# EAGLE design IE ARSA Merah W 4 L (EAGLE 8.4.3)
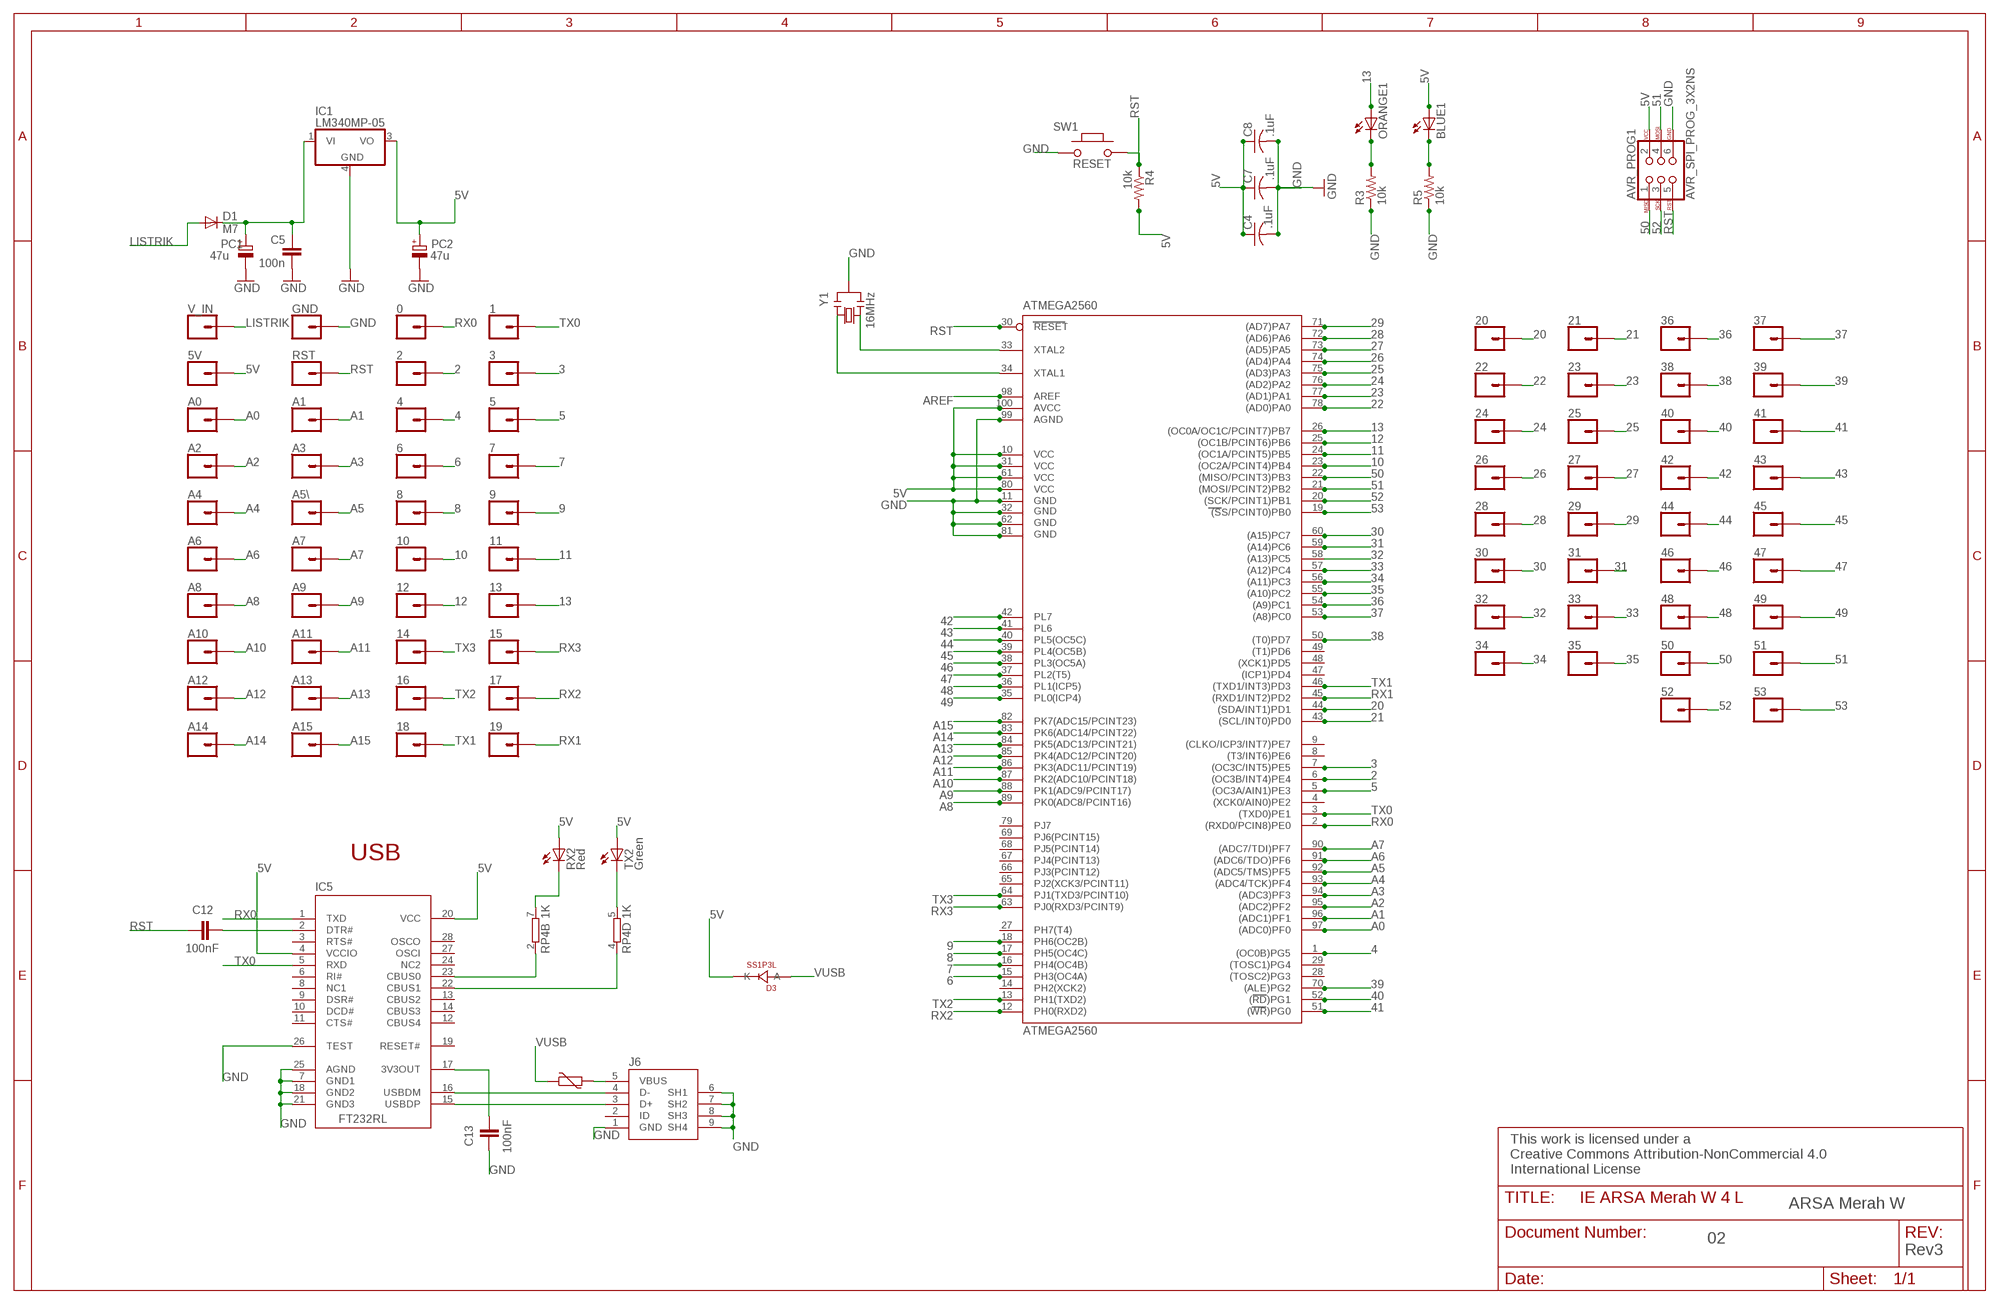
[diagram p0: schematic, sheet 1]

## Parts
0  CONN_01  [1X01]
1  CONN_01  [1X01]
2  CONN_01  [1X01]
3  CONN_01  [1X01]
4  CONN_01  [1X01]
5  CONN_01  [1X01]
5V  CONN_01  [1X01]
6  CONN_01  [1X01]
7  CONN_01  [1X01]
8  CONN_01  [1X01]
9  CONN_01  [1X01]
10  CONN_01  [1X01]
11  CONN_01  [1X01]
12  CONN_01  [1X01]
13  CONN_01  [1X01]
14  CONN_01  [1X01]
15  CONN_01  [1X01]
16  CONN_01  [1X01]
17  CONN_01  [1X01]
18  CONN_01  [1X01]
19  CONN_01  [1X01]
20  CONN_01  [1X01]
21  CONN_01  [1X01]
22  CONN_01  [1X01]
23  CONN_01  [1X01]
24  CONN_01  [1X01]
25  CONN_01  [1X01]
26  CONN_01  [1X01]
27  CONN_01  [1X01]
28  CONN_01  [1X01]
29  CONN_01  [1X01]
30  CONN_01  [1X01]
31  CONN_01  [1X01]
32  CONN_01  [1X01]
33  CONN_01  [1X01]
34  CONN_01  [1X01]
35  CONN_01  [1X01]
36  CONN_01  [1X01]
37  CONN_01  [1X01]
38  CONN_01  [1X01]
39  CONN_01  [1X01]
40  CONN_01  [1X01]
41  CONN_01  [1X01]
42  CONN_01  [1X01]
43  CONN_01  [1X01]
44  CONN_01  [1X01]
45  CONN_01  [1X01]
46  CONN_01  [1X01]
47  CONN_01  [1X01]
48  CONN_01  [1X01]
49  CONN_01  [1X01]
50  CONN_01  [1X01]
51  CONN_01  [1X01]
52  CONN_01  [1X01]
53  CONN_01  [1X01]
A0  CONN_01  [1X01]
A1  CONN_01  [1X01]
A2  CONN_01  [1X01]
A3  CONN_01  [1X01]
A4  CONN_01  [1X01]
A5\  CONN_01  [1X01]
A6  CONN_01  [1X01]
A7  CONN_01  [1X01]
A8  CONN_01  [1X01]
A9  CONN_01  [1X01]
A10  CONN_01  [1X01]
A11  CONN_01  [1X01]
A12  CONN_01  [1X01]
A13  CONN_01  [1X01]
A14  CONN_01  [1X01]
A15  CONN_01  [1X01]
ATMEGA2560  ATMEGA2560  [TQFP100]
AVR_PROG1  AVR_SPI_PROG_3X2NS  [2X3-NS]
BLUE1  L  LED-SMD-0805  [SMD-0805-LED]
C4  CAPACITOR-SMD-0805  [SMD-0805]
C5  100n  C-EU0603-RND  [C0603-ROUND]
C7  .1uF  CAPACITOR-SMD-0805  [SMD-0805]
C8  .1uF  CAPACITOR-SMD-0805  [SMD-0805]
C12  100nF  0015_100NF_0603  [C0603-ROUND]
C13  100nF  0015_100NF_0603  [C0603-ROUND]
D1  M7  DIODE-SMB  [SMB]
D3  SS1P3L  0025_SS1P3L-M3/84A  [DO220AAL]
F3  MFFSMF050  PTC  [0603-1608X90N]
GND  CONN_01  [1X01]
IC1  LM340MP-05  [SOT223]
IC5  FT232RL  0226_FT232RL  [SSOP28]
J6  0219_14850  [USB-MINI-B_2]
ORANGE1  L  LED-SMD-0805  [SMD-0805-LED]
PC1  47u  CPOL-EUD  [PANASONIC_D]
PC2  47u  CPOL-EUD  [PANASONIC_D]
R3  10k  RESISTOR-SMD-0805  [SMD-0805]
R4  10k  RESISTOR-SMD-0805  [SMD-0805]
R5  10k  RESISTOR-SMD-0805  [SMD-0805]
RP4  1K  0005_064R_1K_/_CAY16-102J4LF  [CAY16]
RST  CONN_01  [1X01]
RX2  Red  0181_KTP-2012SURCK  [CHIPLED_0805]
SW1  RESET  0173_IT-1185AP1C-160G-G_T&R  [SMD_157SW]
TX2  Green  0043_KPT-2012SGC  [CHIPLED_0805]
V_IN  CONN_01  [1X01]
Y1  16MHz  0011_CSTCE16M0V53-R0  [RESONATOR]

## Nets
2: 2.1 ATMEGA2560.6((OC3B/INT4)PE4)
3: 3.1 ATMEGA2560.7((OC3C/INT5)PE5)
4: 4.1 ATMEGA2560.1((OC0B)PG5)
5: 5.1 ATMEGA2560.5((OC3A/AIN1)PE3)
5V: 5V.1 ATMEGA2560.10(VCC) ATMEGA2560.31(VCC1) ATMEGA2560.61(VCC2) ATMEGA2560.80(VCC3) ATMEGA2560.100(AVCC) AVR_PROG1.2 BLUE1.1(A) C4.1 C7.1 C8.1 D3.P$1(K) IC1.3(VO) IC5.4(VCCIO) IC5.20(VCC) PC2.+ R4.2 RX2.A TX2.A
6: 6.1 ATMEGA2560.15(PH3(OC4A))
7: 7.1 ATMEGA2560.16(PH4(OC4B))
8: 8.1 ATMEGA2560.17(PH5(OC4C))
9: 9.1 ATMEGA2560.18(PH6(OC2B))
10: 10.1 ATMEGA2560.23((OC2A/PCINT4)PB4)
11: 11.1 ATMEGA2560.24((OC1A/PCINT5)PB5)
12: 12.1 ATMEGA2560.25((OC1B/PCINT6)PB6)
13: 13.1 ATMEGA2560.26((OC0A/OC1C/PCINT7)PB7) ORANGE1.1(A)
20: 20.1 ATMEGA2560.44((SDA/INT1)PD1)
21: 21.1 ATMEGA2560.43((SCL/INT0)PD0)
22: 22.1 ATMEGA2560.78((AD0)PA0)
23: 23.1 ATMEGA2560.77((AD1)PA1)
24: 24.1 ATMEGA2560.76((AD2)PA2)
25: 25.1 ATMEGA2560.75((AD3)PA3)
26: 26.1 ATMEGA2560.74((AD4)PA4)
27: 27.1 ATMEGA2560.73((AD5)PA5)
28: 28.1 ATMEGA2560.72((AD6)PA6)
29: 29.1 ATMEGA2560.71((AD7)PA7)
30: 30.1 ATMEGA2560.60((A15)PC7)
31: 31.1 ATMEGA2560.59((A14)PC6)
32: 32.1 ATMEGA2560.58((A13)PC5)
33: 33.1 ATMEGA2560.57((A12)PC4)
34: 34.1 ATMEGA2560.56((A11)PC3)
35: 35.1 ATMEGA2560.55((A10)PC2)
36: 36.1 ATMEGA2560.54((A9)PC1)
37: 37.1 ATMEGA2560.53((A8)PC0)
38: 38.1 ATMEGA2560.50((T0)PD7)
39: 39.1 ATMEGA2560.70((ALE)PG2)
40: 40.1 ATMEGA2560.52((RD)PG1)
41: 41.1 ATMEGA2560.51((WR)PG0)
42: 42.1 ATMEGA2560.42(PL7)
43: 43.1 ATMEGA2560.41(PL6)
44: 44.1 ATMEGA2560.40(PL5(OC5C))
45: 45.1 ATMEGA2560.39(PL4(OC5B))
46: 46.1 ATMEGA2560.38(PL3(OC5A))
47: 47.1 ATMEGA2560.37(PL2(T5))
48: 48.1 ATMEGA2560.36(PL1(ICP5))
49: 49.1 ATMEGA2560.35(PL0(ICP4))
50: 50.1 ATMEGA2560.22((MISO/PCINT3)PB3) AVR_PROG1.1
51: 51.1 ATMEGA2560.21((MOSI/PCINT2)PB2) AVR_PROG1.4
52: 52.1 ATMEGA2560.20((SCK/PCINT1)PB1) AVR_PROG1.3
53: 53.1 ATMEGA2560.19((SS/PCINT0)PB0)
A0: A0.1 ATMEGA2560.97((ADC0)PF0)
A1: A1.1 ATMEGA2560.96((ADC1)PF1)
A2: A2.1 ATMEGA2560.95((ADC2)PF2)
A3: A3.1 ATMEGA2560.94((ADC3)PF3)
A4: A4.1 ATMEGA2560.93((ADC4/TCK)PF4)
A5: A5\.1 ATMEGA2560.92((ADC5/TMS)PF5)
A6: A6.1 ATMEGA2560.91((ADC6/TDO)PF6)
A7: A7.1 ATMEGA2560.90((ADC7/TDI)PF7)
A8: A8.1 ATMEGA2560.89(PK0(ADC8/PCINT16))
A9: A9.1 ATMEGA2560.88(PK1(ADC9/PCINT17))
A10: A10.1 ATMEGA2560.87(PK2(ADC10/PCINT18))
A11: A11.1 ATMEGA2560.86(PK3(ADC11/PCINT19))
A12: A12.1 ATMEGA2560.85(PK4(ADC12/PCINT20))
A13: A13.1 ATMEGA2560.84(PK5(ADC13/PCINT21))
A14: A14.1 ATMEGA2560.83(PK6(ADC14/PCINT22))
A15: A15.1 ATMEGA2560.82(PK7(ADC15/PCINT23))
AREF: ATMEGA2560.98(AREF)
GND: ATMEGA2560.11(GND) ATMEGA2560.32(GND1) ATMEGA2560.62(GND2) ATMEGA2560.81(GND3) ATMEGA2560.99(AGND) AVR_PROG1.6 C4.2 C5.2 C7.2 C8.2 C13.1 GND.1 IC1.4(GND) IC5.7(GND1) IC5.18(GND2) IC5.21(GND3) IC5.25(AGND) IC5.26(TEST) J6.1(GND) J6.6(SH1) J6.7(SH2) J6.8(SH3) J6.9(SH4) PC1.- PC2.- R3.1 R5.1 SW1.1 Y1.2
LISTRIK: D1.A V_IN.1
N$1: ORANGE1.2(C) R3.2
N$2: ATMEGA2560.33(XTAL2) Y1.3
N$3: BLUE1.2(C) R5.2
N$4: ATMEGA2560.34(XTAL1) Y1.1
N$19: C12.2 IC5.2(DTR#)
N$20: IC5.15(USBDP) J6.3(D+)
N$21: IC5.16(USBDM) J6.4(D-)
N$22: IC5.23(CBUS0) RP4.2
N$23: IC5.22(CBUS1) RP4.4
N$24: RP4.5 TX2.C
N$25: F3.2 J6.5(VBUS)
N$27: RP4.7 RX2.C
N$28: C13.2 IC5.17(3V3OUT)
RST: ATMEGA2560.30(RESET) AVR_PROG1.5 C12.1 R4.1 RST.1 SW1.2
RX0: 0.1 ATMEGA2560.2((RXD0/PCIN8)PE0) IC5.1(TXD)
RX1: 19.1 ATMEGA2560.45((RXD1/INT2)PD2)
RX2: 17.1 ATMEGA2560.12(PH0(RXD2))
RX3: 15.1 ATMEGA2560.63(PJ0(RXD3/PCINT9))
TX0: 1.1 ATMEGA2560.3((TXD0)PE1) IC5.5(RXD)
TX1: 18.1 ATMEGA2560.46((TXD1/INT3)PD3)
TX2: 16.1 ATMEGA2560.13(PH1(TXD2))
TX3: 14.1 ATMEGA2560.64(PJ1(TXD3/PCINT10))
VIN: C5.1 D1.C IC1.1(VI) PC1.+
VUSB: D3.P$2(A) F3.1
Unconnected: ATMEGA2560.4((XCK0/AIN0)PE2) ATMEGA2560.8((T3/INT6)PE6) ATMEGA2560.9((CLKO/ICP3/INT7)PE7) ATMEGA2560.14(PH2(XCK2)) ATMEGA2560.27(PH7(T4)) ATMEGA2560.28((TOSC2)PG3) ATMEGA2560.29((TOSC1)PG4) ATMEGA2560.47((ICP1)PD4) ATMEGA2560.48((XCK1)PD5) ATMEGA2560.49((T1)PD6) ATMEGA2560.65(PJ2(XCK3/PCINT11)) ATMEGA2560.66(PJ3(PCINT12)) ATMEGA2560.67(PJ4(PCINT13)) ATMEGA2560.68(PJ5(PCINT14)) ATMEGA2560.69(PJ6(PCINT15)) ATMEGA2560.79(PJ7) IC5.3(RTS#) IC5.6(RI#) IC5.8(NC1) IC5.9(DSR#) IC5.10(DCD#) IC5.11(CTS#) IC5.12(CBUS4) IC5.13(CBUS2) IC5.14(CBUS3) IC5.19(RESET#) IC5.24(NC2) IC5.27(OSCI) IC5.28(OSCO) J6.2(ID) RP4.1 RP4.3 RP4.6 RP4.8

## Notes on the sheet
- .1uF
- USB
- This work is licensed under a 
  Creative Commons Attribution-NonCommercial 4.0
  International License
- ARSA Merah W
- 02
- Rev3

## Library data of the parts
0 1-5 5V 6-53 A0 A1-A4 A5\ A6-A15 GND RST V_IN = SparkFun-Connectors:CONN_01: Single connection point. Often used as Generic Header-pin footprint for 0.1 inch spaced/style header connections On any of the 0.1 inch spaced packages, you can populate with these: Break Away Headers - Straight <https://www.sparkfun.com/products/116> (PRT-00116) Break Away Male Headers - Right Angle <https://www.sparkfun.com/products/553> (PRT-00553) Female Headers <https://www.sparkfun.com/products/115> (PRT-00115) Break Away Headers - Machine Pin <https://www.sparkfun.com/products/117> (PRT-00117) Break Away Female Headers - Swiss Machine Pin <https://www.sparkfun.com/products/743> (PRT-00743) This device is also useful as a general connection point to wire up your design to another part of your project. Our various solder wires solder well into these plated through hole pads. Hook-Up Wire - Assortment (Stranded, 22 AWG) <https://www.sparkfun.com/products/11375> (PRT-11375) Hook-Up Wire - Assortment (Solid Core, 22 AWG) <https://www.sparkfun.com/products/11367> (PRT-11367) View the entire wire category on our website here <https://www.sparkfun.com/categories/141> Special notes: SMTSO-256-ET is a "flush mount" nut for a 4-40 screw. We mostly use this on specialty testbeds; it is a nice way to connect hardware to your PCB at an adjustable hieght. Also note, the SNAP packages are for using a snappable style connector. We sell a baggie of snaps and they are also used on two LilyPad designs: Snap Assortment - 30 pack (male and female) <https://www.sparkfun.com/products/11347> (DEV-11347) LilyPad Arduino SimpleSnap <https://www.sparkfun.com/products/10941> (DEV-10941) LilyPad SimpleSnap Protoboard <https://www.sparkfun.com/products/10940> (DEV-10940)
ATMEGA2560 = Fuzzy:ATMEGA2560
AVR_PROG1 = SparkFun-Connectors:AVR_SPI_PROG_3X2: AVR ISP 6 Pin This is the reduced ISP connector for AVR programming. Common on Arduino. This footprint will take up less PCB space and can be used with a 10-pin to 6-pin adapter such as SKU: BOB-08508 **Special note about "TEST_POINT" package. The stop mask is on the top side, so if you want your programming test points to be on the bottom of your board, make sure to place this package on the bottom side of the board. This also ensure that the orientation to program from the bottom side will be correct. SparkFun Products: SparkFun ISP Pogo Adapter <https://www.sparkfun.com/products/11591> - NS Tiny AVR Programmer <https://www.sparkfun.com/products/11801> -PTH
BLUE1 ORANGE1 = Fuzzy:LED-SMD-0805
C4 C7 C8 = Fuzzy:CAPACITOR-SMD-0805
C5 = SmartPrj:C-EU: CAPACITOR, European symbol
C12 C13 = Condensatori:0015_100NF_0603: 100nF 0603 50V; CASE: 0603; MONTHLY_USAGE: _____; PART_NUMBER: cl10b104kbnc; PRICE: _____; SUPPLIER: _____; TYPE: Condensatori
D1 = diode:DIODE-: DIODE
D3 = Diodi:0025_SS1P3L-M3/84A: 1A 30V Schottky Barrier Rectifiers -SS1P3L-M3/84A; CASE: SMP; MONTHLY_USAGE: _____; PART_NUMBER: SS1P3L-M3/84A; PRICE: _____; SUPPLIER: _____; TYPE: Diodi
F3 = Arduino-rcl:PTC: SMD PTC; DATASHEET: http://www.bourns.com/docs/Product-Datasheets/mffsmf.pdf; DISTRIBUTOR-LINK: http://www.digikey.com/product-detail/en/bourns-inc/MF-FSMF050X-2/MF-FSMF050X-2CT-ND/2039389; DISTRIBUTOR-PN: MF-FSMF050X-2CT-ND; MANUFACTURER: Bourns Inc; MANUFACTURER-PN: MF-FSMF050X-2
IC1 = linear:LM340?-*: Positive VOLTAGE REGULATOR Source: http://cache.national.com/ds/LM/LM340.pdf
IC5 = IntegratedCircuits:0226_FT232RL: USB to serial UART interface -FT232RL; CASE: SSOP28; MONTHLY_USAGE: _____; PART_NUMBER: FT232RL; PRICE: _____; SUPPLIER: _____; TYPE: Circuito_Integrato
J6 = Connettori:0219_14850: Usb-Mini F 90 Smd; MONTHLY_USAGE: _____; PART_NUMBER: 14850; PRICE: _____; SUPPLIER: _____; TYPE: Connettori; VALUE: USB-mini-90 -SMD
PC1 PC2 = rcl:CPOL-EU: POLARIZED CAPACITOR, European symbol
R3-R5 = Fuzzy:RESISTOR-SMD-0805
RP4 = Resistenze:0005_064R_1K_/_CAY16-102J4LF: 1K 064R; CASE: SMD_3,2x1,6; MONTHLY_USAGE: _____; PART_NUMBER: 064R_1K_/_CAY16-102J4LF; PRICE: _____; SUPPLIER: _____; TYPE: Resistenze
RX2 = Opto:0181_KTP-2012SURCK: LED RED - SMD - 0805; MONTHLY_USAGE: _____; PART_NUMBER: KTP-2012SURCK; PRICE: _____; SUPPLIER: _____; TYPE: Opto
SW1 = Switches:0173_IT-1185AP1C-160G-G_T&R: Pushbutton 4x3 SMD H2,5mm; MONTHLY_USAGE: _____; PART_NUMBER: IT-1185AP1C-160G-G_T&R; PRICE: _____; SUPPLIER: _____; TYPE: Switches; VALUE: 157SW
TX2 = Opto:0043_KPT-2012SGC: LED GREEN - SMD-0805; MONTHLY_USAGE: _____; PART_NUMBER: KPT-2012SGC; PRICE: _____; SUPPLIER: _____; TYPE: Opto
Y1 = Cristalli:0011_CSTCE16M0V53-R0: 16Mhz - SMD; MONTHLY_USAGE: _____; PART_NUMBER: CSTCE16M0V53-R0; PRICE: _____; SUPPLIER: _____; TYPE: Cristalli; VALUE: CSTCE16M0V53-R0

## Net classes
0 default: width 0.15 mm, drill 0.3 mm, clearance 0.15 mm
1 Power: width 0.46 mm, drill 0.3 mm, clearance 0.15 mm

## Board
ARSA Merah W
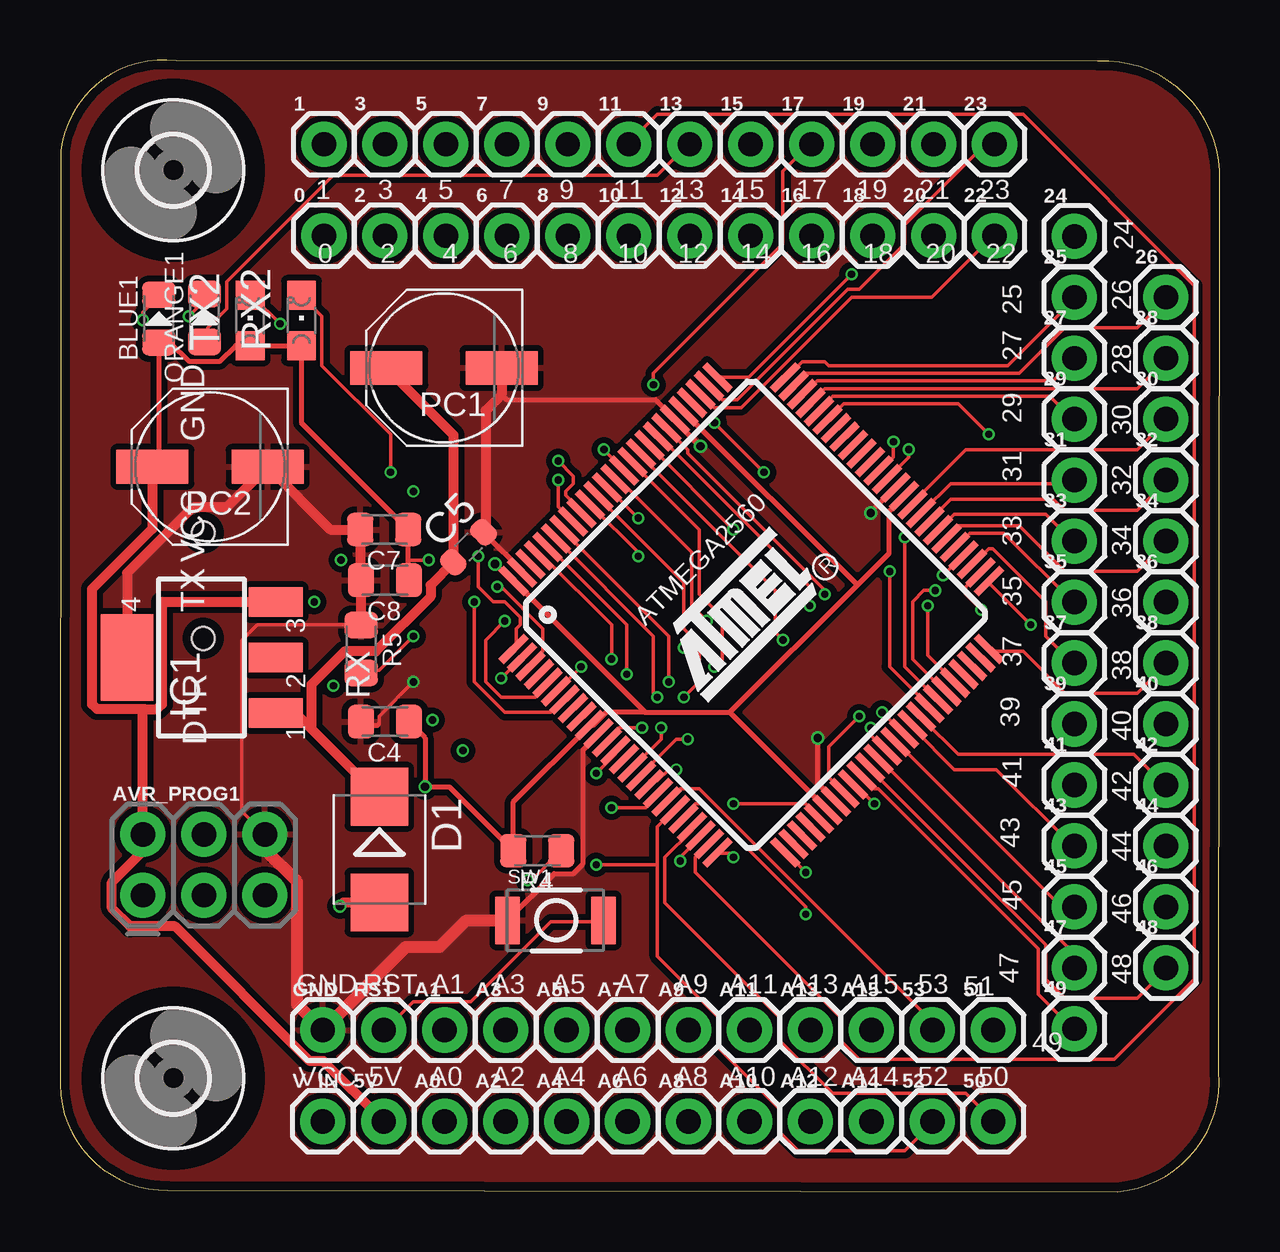
[diagram p1: board, top side]
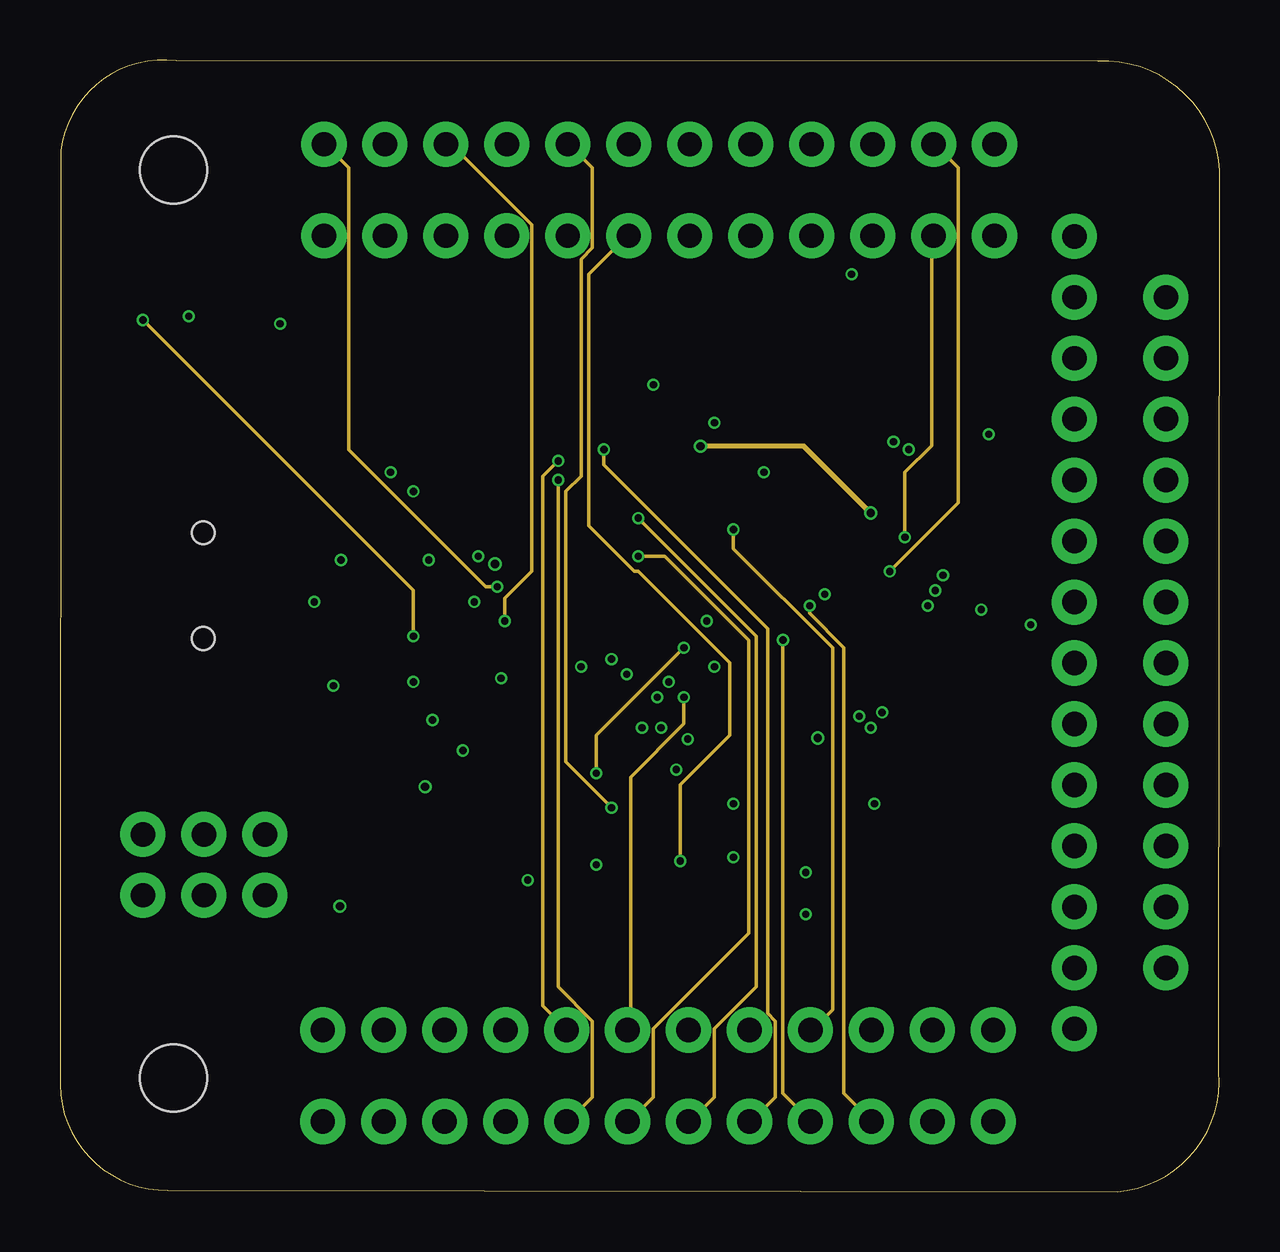
[diagram p2: board, inner layer Route2]
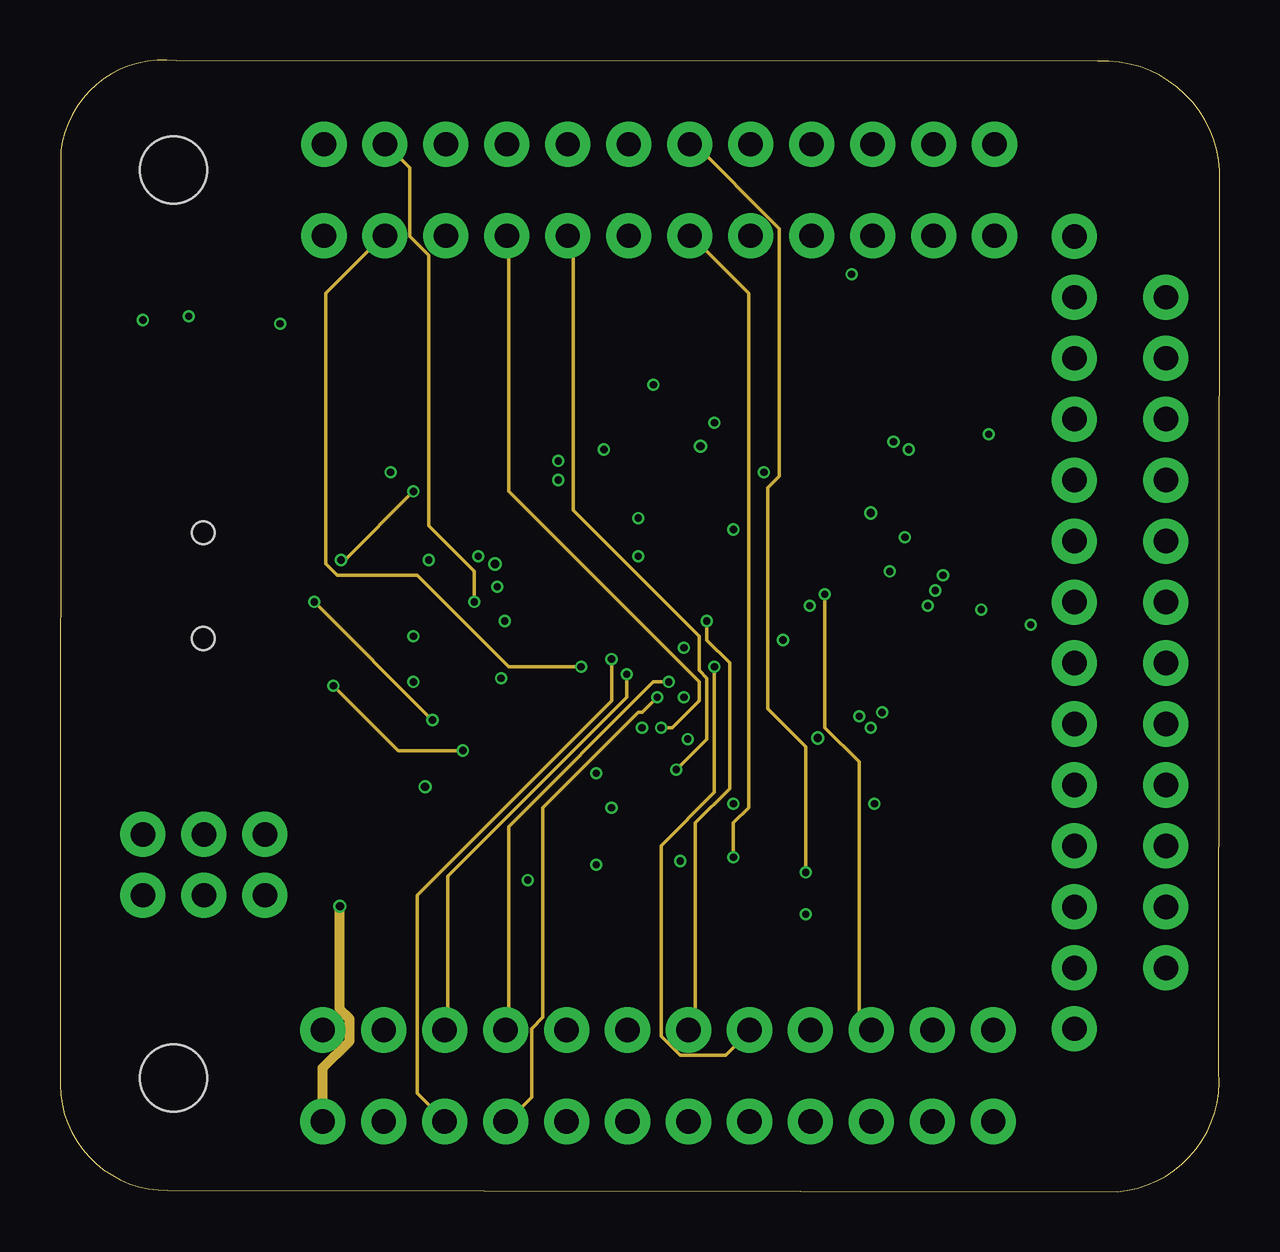
[diagram p3: board, inner layer Route15]
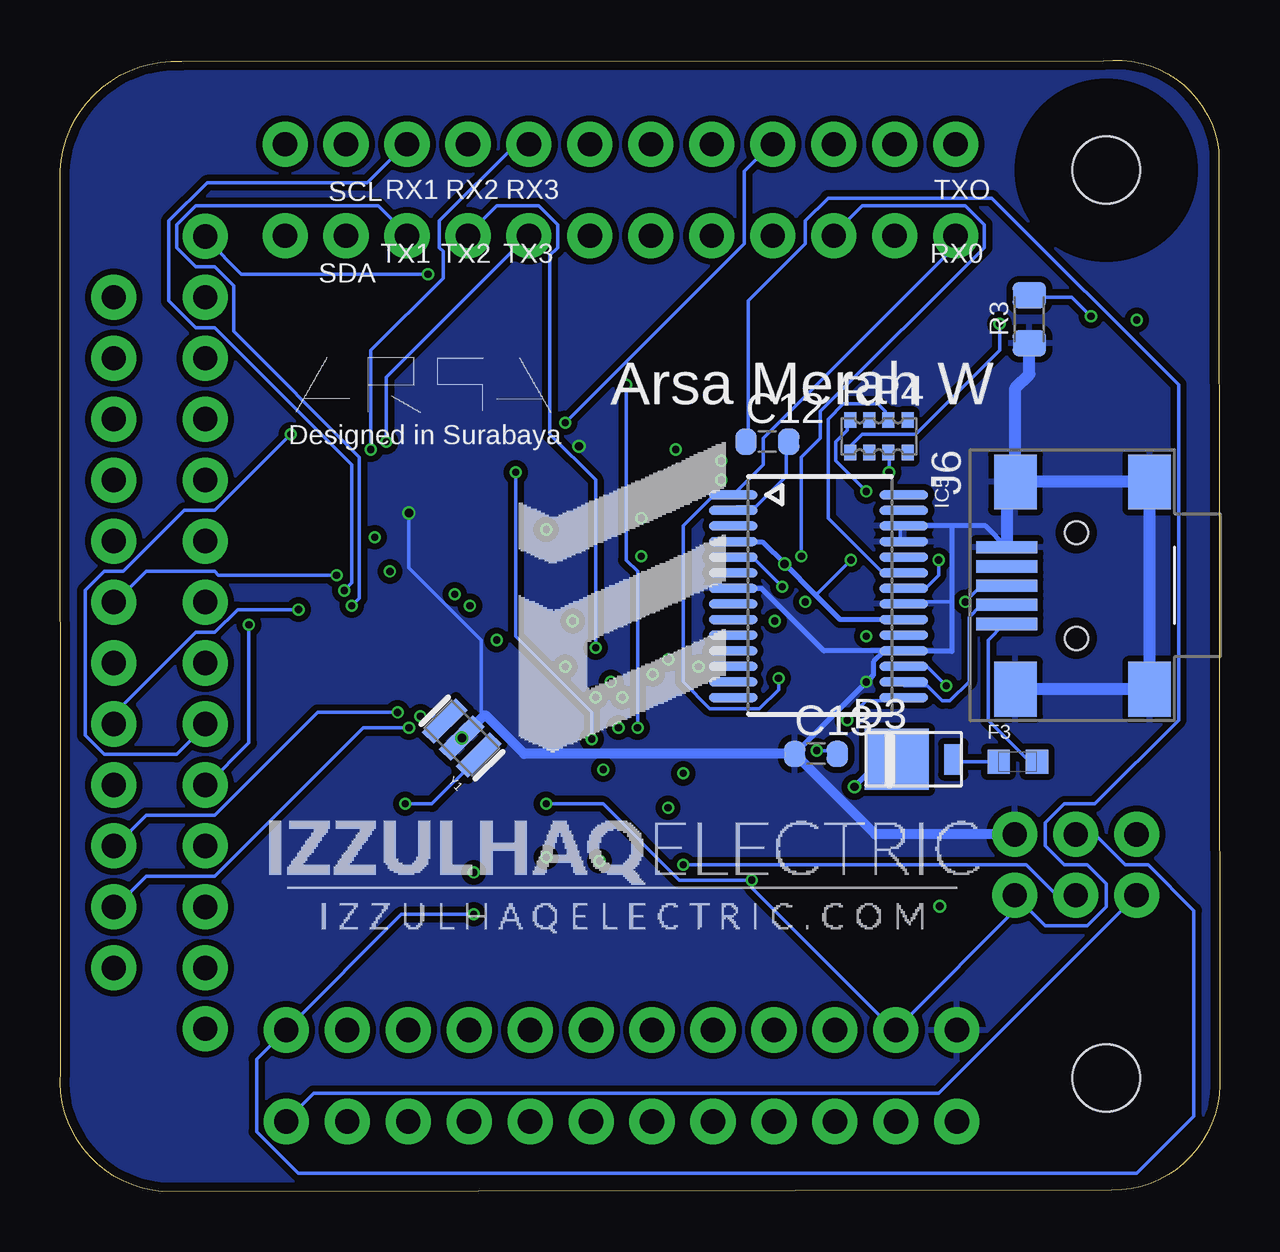
[diagram p4: board, bottom side, seen from below]

Size 48.32 x 47.15 mm. Coordinates in mm from the lower left corner, seen from the top.
Outline: 43.25,47.09 4.84,47.12 arc90 0.03,43.36 0,4.45 arc90 4.5,0.05 44.05,0 arc90 48.29,4.97 48.32,42.53 arc90 43.25,47.09
Copper layers (1*2*15*16): Top 0.035559375mm / dielectric 0.17018125mm / Route2 0.01778125mm / dielectric 47mil / Route15 0.01778125mm / dielectric 0.17018125mm / Bottom 0.035559375mm
Design rules "oshpark-4layer-tented": minimum track width 5mil, minimum drill 10mil, track to track 5mil, track to pad 5mil, pad to pad 5mil, via to via 5mil, smd to smd 5mil, copper to edge 15mil, drill to drill 6mil, minimum pad ring 4mil, minimum via ring 4mil, stop-mask expansion 2.5mil, vias tented up to drill 20mil, thermal gap 10mil

### Footprints (pad centres in the part's own frame; a part is rotated, then mirrored left to right if it is on the bottom)
1X01 = drill 1.016 pad 1.88: 1 0,0
TQFP100 = smd 1.5 x 0.3: 1 -8,6; 2 -8,5.5; 3 -8,5; 4 -8,4.5; 5 -8,4; 6 -8,3.5; 7 -8,3; 8 -8,2.5; 9 -8,2; 10 -8,1.5; 11 -8,1; 12 -8,0.5; 13 -8,0; 14 -8,-0.5; 15 -8,-1; 16 -8,-1.5; 17 -8,-2; 18 -8,-2.5; 19 -8,-3; 20 -8,-3.5; 21 -8,-4; 22 -8,-4.5; 23 -8,-5; 24 -8,-5.5; 25 -8,-6; 51 8,-6; 52 8,-5.5; 53 8,-5; 54 8,-4.5; 55 8,-4; 56 8,-3.5; 57 8,-3; 58 8,-2.5; 59 8,-2; 60 8,-1.5; 61 8,-1; 62 8,-0.5; 63 8,0; 64 8,0.5; 65 8,1; 66 8,1.5; 67 8,2; 68 8,2.5; 69 8,3; 70 8,3.5; 71 8,4; 72 8,4.5; 73 8,5; 74 8,5.5; 75 8,6 | smd 0.3 x 1.5: 26 -6,-8; 27 -5.5,-8; 28 -5,-8; 29 -4.5,-8; 30 -4,-8; 31 -3.5,-8; 32 -3,-8; 33 -2.5,-8; 34 -2,-8; 35 -1.5,-8; 36 -1,-8; 37 -0.5,-8; 38 0,-8; 39 0.5,-8; 40 1,-8; 41 1.5,-8; 42 2,-8; 43 2.5,-8; 44 3,-8; 45 3.5,-8; 46 4,-8; 47 4.5,-8; 48 5,-8; 49 5.5,-8; 50 6,-8; 76 6,8; 77 5.5,8; 78 5,8; 79 4.5,8; 80 4,8; 81 3.5,8; 82 3,8; 83 2.5,8; 84 2,8; 85 1.5,8; 86 1,8; 87 0.5,8; 88 0,8; 89 -0.5,8; 90 -1,8; 91 -1.5,8; 92 -2,8; 93 -2.5,8; 94 -3,8; 95 -3.5,8; 96 -4,8; 97 -4.5,8; 98 -5,8; 99 -5.5,8; 100 -6,8
2X3-NS = drill 1.016 pad 1.88: 1 -2.54,-1.27; 2 -2.54,1.27; 3 0,-1.27; 4 0,1.27; 5 2.54,-1.27; 6 2.54,1.27
SMD-0805-LED = smd 1.1 x 1.4: 1 -1,0; 2 1,0
SMD-0805 = smd 1.1 x 1.4: 1 -1,0; 2 1,0
C0603-ROUND = smd 0.898 x 1.1: 1 -0.889,0; 2 0.889,0
SMB = smd 2.4 x 2.4: A 2.2,0; C -2.2,0
DO220AAL = smd 2.667 x 2.54: P$1 -0.7,0 | smd 0.762 x 1.27: P$2 1.65,0
0603-1608X90N = smd 0.95 x 1: 1 -0.8,0; 2 0.8,0
SOT223 = smd 1.219 x 2.235: 1 -2.311,-3.099; 2 0,-3.099; 3 2.311,-3.099 | smd 3.6 x 2.2: 4 0,3.099
SSOP28 = smd 0.381 x 2.032: 1 0,0; 2 0.65,0; 3 1.3,0; 4 1.95,0; 5 2.6,0; 6 3.25,0; 7 3.9,0; 8 4.55,0; 9 5.2,0; 10 5.85,0; 11 6.5,0; 12 7.15,0; 13 7.8,0; 14 8.45,0; 15 8.45,7.112; 16 7.8,7.112; 17 7.15,7.112; 18 6.5,7.112; 19 5.85,7.112; 20 5.2,7.112; 21 4.55,7.112; 22 3.9,7.112; 23 3.25,7.112; 24 2.6,7.112; 25 1.95,7.112; 26 1.3,7.112; 27 0.65,7.112; 28 0,7.112
USB-MINI-B_2 = smd 0.508 x 2.54: 1 0,0; 2 0.8,0; 3 1.6,0; 4 2.4,0; 5 3.2,0 | smd 2.286 x 1.778: 6 -2.717,5.948; 7 -2.717,0.36; 8 5.918,0.36; 9 5.918,5.948 | hole 0.95: -0.6,2.9; 3.8,2.9
PANASONIC_D = smd 3 x 1.4: + 2.4,0; - -2.4,0
CAY16 = smd 0.5 x 0.65: 1 -1.2,-0.675; 2 -0.4,-0.675; 3 0.4,-0.675; 4 1.2,-0.675; 5 1.2,0.675; 6 0.4,0.675; 7 -0.4,0.675; 8 -1.2,0.675
CHIPLED_0805 = smd 1.2 x 1.2: A 0,-1.05; C 0,1.05
SMD_157SW = smd 1.016 x 1.981: 1 0,0; 2 4,0
2,8 = hole 2.8: 0,0
RESONATOR = smd 0.7 x 2: 1 -1,0; 2 0,0; 3 1,0

### Placement (x,y rotation side)
0  11,39.83 0 top
1  11,43.64 0 top
2  13.54,39.83 0 top
3  13.54,43.64 0 top
4  16.08,39.83 0 top
5  16.08,43.64 0 top
5V  13.49,2.92 0 top
6  18.62,39.83 0 top
7  18.62,43.64 0 top
8  21.16,39.83 0 top
9  21.16,43.64 0 top
10  23.7,39.83 0 top
11  23.7,43.64 0 top
12  26.24,39.83 0 top
13  26.24,43.64 0 top
14  28.78,39.83 0 top
15  28.78,43.64 0 top
16  31.32,39.83 0 top
17  31.32,43.64 0 top
18  33.86,39.83 0 top
19  33.86,43.64 0 top
20  36.4,39.83 0 top
21  36.4,43.64 0 top
22  38.94,39.83 0 top
23  38.94,43.64 0 top
24  42.27,39.8 0 top
25  42.27,37.26 0 top
26  46.08,37.26 0 top
27  42.27,34.72 0 top
28  46.08,34.72 0 top
29  42.27,32.18 0 top
30  46.08,32.18 0 top
31  42.27,29.64 0 top
32  46.08,29.64 0 top
33  42.27,27.1 0 top
34  46.08,27.1 0 top
35  42.27,24.56 0 top
36  46.08,24.56 0 top
37  42.27,22.02 0 top
38  46.08,22.02 0 top
39  42.27,19.48 0 top
40  46.08,19.48 0 top
41  42.27,16.94 0 top
42  46.08,16.94 0 top
43  42.27,14.4 0 top
44  46.08,14.4 0 top
45  42.27,11.86 0 top
46  46.08,11.86 0 top
47  42.27,9.32 0 top
48  46.08,9.32 0 top
49  42.27,6.78 0 top
50  38.89,2.92 0 top
51  38.89,6.73 0 top
52  36.35,2.92 0 top
53  36.35,6.73 0 top
A0  16.03,2.92 0 top
A1  16.03,6.73 0 top
A2  18.57,2.92 0 top
A3  18.57,6.73 0 top
A4  21.11,2.92 0 top
A5\  21.11,6.73 0 top
A6  23.65,2.92 0 top
A7  23.65,6.73 0 top
A8  26.19,2.92 0 top
A9  26.19,6.73 0 top
A10  28.73,2.92 0 top
A11  28.73,6.73 0 top
A12  31.27,2.92 0 top
A13  31.27,6.73 0 top
A14  33.81,2.92 0 top
A15  33.81,6.73 0 top
ATMEGA2560  28.8,24.03 45 top
AVR_PROG1  5.99,13.61 0 top
BLUE1  4.11,36.37 90 top
C4  13.54,19.58 180 top
C5  17.02,26.85 45 top
C7  13.51,27.58 180 top
C8  13.54,25.48 180 top
C12  18.85,31.24 0 bottom
C13  16.81,18.24 0 bottom
D1  13.31,14.25 270 top
D3  12.75,18.01 0 bottom
F3  8.41,17.91 0 bottom
GND  10.95,6.73 0 top
IC1  5.89,22.25 90 top
IC5  20.27,29.03 270 bottom
J6  8.86,26.85 270 bottom
ORANGE1  6.02,36.4 90 top
PC1  16,34.32 180 top
PC2  6.25,30.2 180 top
R3  7.92,36.35 90 bottom
R4  19.89,14.2 180 top
R5  12.55,22.61 270 top
RP4  14.2,31.47 180 bottom
RST  13.49,6.73 0 top
RX2  10.06,36.3 0 top
SW1  18.64,11.3 0 top
TX2  7.92,36.3 0 top
U$1  [2,8]  4.72,42.56 0 top
U$2  [2,8]  4.72,4.72 0 top
V_IN  10.95,2.92 0 top
Y1  31.57,18.9 135 bottom

### Tracks (layer width: path | path; a pad name or v marks a point on that pad's centre or on a via)
2  (via drill 0.3)
  Top 0.15: v21.71,21.87 20.76,20.92 ATMEGA2560.6
  Route15 0.15: v21.71,21.87 18.69,21.87 14.88,25.68 11.55,25.68 11.07,26.16 11.07,37.43 13.46,39.81 2.1
3  (via drill 0.3)
  Top 0.15: v17.27,24.57 17.27,21.23 18.54,19.96 20.44,19.96 20.92,20.44 ATMEGA2560.7
  Route15 0.15: v17.27,24.57 17.27,25.84 15.36,27.74 15.36,39.01 14.57,39.81 14.57,42.67 13.61,43.62 3.1
4  (via drill 0.3)
  Top 0.15: v17.42,26.47 17.42,25.2 18.06,24.57 18.54,24.57 19.17,23.93 19.17,23.62 19.01,23.46 19.01,22.66 ATMEGA2560.1
  Bottom 0.15: v17.42,26.47 17.42,30.6 16.63,31.39 16.63,32.51 9.8,39.33 9.8,40.28 10.6,41.08 14.88,41.08 16,39.97 4.1
5  (via drill 0.3)
  Top 0.15: v18.54,23.77 17.74,22.98 17.74,21.23 18.38,20.6 19.81,20.6 20.28,21.08 ATMEGA2560.5
  Route2 0.15: v18.54,23.77 18.54,24.73 19.65,25.84 19.65,40.28 16.15,43.78 5.1
5V  (via drill 0.3, 0.35)
  Top 0.15: 14.51,26.31 v15.36,26.31
  Top 0.203: 3.85,29.79 4.11,30.06 BLUE1.1 4.6,35.37 5.38,34.6 6.66,34.6 7.31,35.25 TX2.A RX2.A 10.06,32.04 C7.1 14.51,26.31 14.51,25.5 C8.1 | 24.38,19.97 22.76,19.97 22.23,19.43 ATMEGA2560.10 18.89,16.23 R4.2 16.22,16.87 v15.21,16.87 15.21,18.91 C4.1 | 27.92,19.97 24.51,19.97 24.38,19.97 | 27.92,19.97 ATMEGA2560.31 | 24.38,19.97 ATMEGA2560.100 18.83,25.44 v18.12,26.15 | 33.17,25.22 27.92,19.97 | 33.17,25.22 34.54,26.6 34.54,28.35 ATMEGA2560.61 | ATMEGA2560.80 33.17,25.32 33.17,25.22
  Top 0.406: 3.53,20.1 4.04,20.1 4.25,20.3 4.25,24.56 IC1.3 | 3.53,20.1 1.55,20.1 1.34,20.3 1.34,24.2 1.34,25.11 3.85,27.62 3.85,29.79 PC2.+ | 3.85,35.11 BLUE1.1 | 3.53,20.1 3.45,20.02 AVR_PROG1.2 3.45,14.17 2.16,12.88 2.16,11.81 2.92,11.05 4.8,11.05 10.41,5.44 10.97,5.44 5V.1
  Bottom 0.15: v15.36,26.31 16.82,24.85
  Bottom 0.203: D3.P$1 14.07,18.01 v15.21,16.87 | IC5.20 15.81,23.83 16.82,24.85 v18.12,26.15 19.02,27.05 20.24,27.05 IC5.4
6  (via drill 0.3)
  Top 0.15: v25.04,19.33 25.04,18.85 23.93,17.74 ATMEGA2560.15
  Route15 0.15: v25.04,19.33 25.52,19.33 26.63,20.44 26.63,21.23 18.69,29.17 18.69,39.81 6.1
7  (via drill 0.3)
  Top 0.15: v26.16,18.85 25.68,18.85 24.25,17.42 ATMEGA2560.16 | v27.27,32.03 v29.33,29.97
  Bottom 0.15: v26.16,18.85 26.16,19.96 29.33,23.14 v29.33,29.97 | v27.27,32.03 19.81,39.49 19.81,42.51 18.69,43.62 7.1
8  (via drill 0.3)
  Top 0.15: v25.68,17.58 25.36,17.58 24.89,17.11 24.57,17.11 ATMEGA2560.17
  Route15 0.15: v25.68,17.58 26.95,18.85 26.95,21.39 26.63,21.71 26.63,23.14 21.39,28.38 21.39,39.65 21.23,39.81 8.1
9  (via drill 0.3)
  Top 0.15: v22.98,16 24.41,16 24.89,16.47 ATMEGA2560.18
  Route2 0.15: v22.98,16 21.08,17.9 21.08,29.17 21.71,29.81 21.71,38.86 22.19,39.33 22.19,42.67 21.23,43.62 9.1
10  (via drill 0.3)
  Top 0.15: v25.84,13.77 25.84,13.93 26.63,14.73 ATMEGA2560.23
  Route2 0.15: v25.84,13.77 25.84,16.95 27.9,19.01 27.9,22.03 24.09,25.84 23.93,25.84 22.03,27.74 22.03,38.22 23.62,39.81 10.1
11
  Top 0.15: ATMEGA2560.24 26.95,14.41 26.47,13.93 26.47,13.3 32.51,7.26 32.51,6.31 33.3,5.52 43.94,5.52 47.27,8.85 47.27,37.74 40.13,44.89 24.89,44.89 23.77,43.78 11.1
12  (via drill 0.3)
  Top 0.15: v28.06,13.93 27.9,14.09 27.43,14.09 ATMEGA2560.25
  Route15 0.15: v28.06,13.93 28.06,15.36 28.7,16 28.7,37.43 26.31,39.81 12.1
13  (via drill 0.3)
  Top 0.15: ORANGE1.1 6.15,35.52 6.15,36 6.95,36.79 6.95,37.9 11.39,42.35 24.89,42.35 26.16,43.62 13.1 | v31.08,13.3 30.28,14.09 ATMEGA2560.26
  Route15 0.15: v31.08,13.3 31.08,18.54 29.49,20.12 29.49,29.33 29.97,29.81 29.97,40.13 26.31,43.78 13.1
20  (via drill 0.3)
  Top 0.15: v35.2,27.27 35.2,21.87 36.47,20.6 ATMEGA2560.44
  Route2 0.15: v35.2,27.27 35.2,29.97 36.32,31.08 36.32,39.81 20.1
21  (via drill 0.3)
  Top 0.15: v34.57,25.84 34.57,21.87 36.16,20.28 ATMEGA2560.43
  Route2 0.15: v34.57,25.84 37.43,28.7 37.43,42.67 36.47,43.62 21.1
22
  Top 0.15: ATMEGA2560.78 26.79,33.14 27.27,32.66 28.38,32.66 32.98,37.27 36.32,37.27 38.86,39.81 22.1
23
  Top 0.15: ATMEGA2560.77 27.11,33.46 27.58,32.98 28.22,32.98 32.82,37.59 33.3,37.59 35.2,39.49 35.2,40.28 38.54,43.62 38.86,43.62 23.1
24  (via drill 0.3)
  Top 0.15: v32.98,38.22 28.7,33.93 27.43,33.93 ATMEGA2560.76
  Bottom 0.15: v32.98,38.22 40.76,38.22 42.19,39.65 24.1
25
  Top 0.15: ATMEGA2560.75 30.28,33.93 30.92,34.57 31.87,34.57 32.03,34.41 39.49,34.41 42.19,37.11 25.1
26
  Top 0.15: ATMEGA2560.74 30.6,33.62 31.08,34.09 39.97,34.09 41.87,36 44.89,36 46,37.11 26.1
27
  Top 0.15: ATMEGA2560.73 31.08,33.3 31.55,33.78 41.4,33.78 42.19,34.57 27.1
28
  Top 0.15: ATMEGA2560.72 31.39,32.98 31.87,33.46 44.89,33.46 46,34.57 28.1
29
  Top 0.15: ATMEGA2560.71 31.71,32.66 32.19,33.14 41.24,33.14 42.19,32.19 29.1
30
  Top 0.15: ATMEGA2560.60 35.52,28.7 37.74,30.92 44.89,30.92 46,32.03 30.1
31
  Top 0.15: ATMEGA2560.59 36,28.38 37.11,29.49 42.19,29.49 31.1
32
  Top 0.15: ATMEGA2560.58 36.32,28.06 37.11,28.85 41.4,28.85 41.87,28.38 44.89,28.38 46,29.49 32.1
33
  Top 0.15: ATMEGA2560.57 36.63,27.58 37.27,28.22 41.08,28.22 42.19,27.11 33.1
34
  Top 0.15: ATMEGA2560.56 36.95,27.27 37.43,27.74 39.97,27.74 41.87,25.84 44.89,25.84 46,26.95 34.1
35
  Top 0.15: ATMEGA2560.55 37.43,26.95 37.9,27.43 39.33,27.43 42.19,24.57 35.1
36  (via drill 0.3)
  Top 0.15: v36.79,25.68 37.59,26.47 ATMEGA2560.54
  Bottom 0.15: v36.79,25.68 41.71,25.68 41.87,25.84 44.73,25.84 46,24.57 36.1
37
  Top 0.15: ATMEGA2560.53 38.06,26.16 38.7,26.79 38.86,26.79 41.08,24.57 41.08,23.14 42.19,22.03 37.1
38
  Top 0.15: ATMEGA2560.50 38.86,22.5 40.13,22.5 41.87,20.76 44.89,20.76 46,21.87 38.1
39  (via drill 0.3)
  Top 0.15: v38.7,31.55 37.43,32.82 32.66,32.82 32.03,32.19 ATMEGA2560.70
  Bottom 0.15: v38.7,31.55 41.87,28.38 43.14,28.38 45.68,25.84 46.48,25.84 47.27,25.04 47.27,19.01 46.48,18.22 43.46,18.22 42.35,19.33 39.1
40  (via drill 0.3)
  Top 0.15: v38.38,24.25 37.74,24.89 37.74,25.2 38.22,25.68 ATMEGA2560.52
  Bottom 0.15: v38.38,24.25 40.92,24.25 41.87,23.3 42.67,23.3 46,19.96 46,19.49 40.1
41  (via drill 0.3)
  Top 0.15: v40.44,23.62 38.7,25.36 ATMEGA2560.51
  Bottom 0.15: v40.44,23.62 40.44,18.69 42.19,16.95 41.1
42
  Top 0.15: ATMEGA2560.42 36,19.65 37.43,18.22 44.73,18.22 46,16.95 42.1
43
  Top 0.15: ATMEGA2560.41 35.52,19.33 37.27,17.58 39.01,17.58 42.19,14.41 43.1
44  (via drill 0.3)
  Top 0.15: v34.25,19.96 35.05,19.17 ATMEGA2560.40
  Bottom 0.15: v34.25,19.96 37.59,19.96 41.87,15.68 44.73,15.68 46,14.41 44.1
45
  Top 0.15: ATMEGA2560.39 34.89,18.69 41.71,11.87 42.19,11.87 45.1
46  (via drill 0.3)
  Top 0.15: v33.78,19.33 33.78,19.01 34.41,18.38 ATMEGA2560.38
  Bottom 0.15: v33.78,19.33 35.68,19.33 41.87,13.14 44.73,13.14 46,11.87 46.1
47
  Top 0.15: ATMEGA2560.37 34.25,17.9 42.19,9.96 42.19,9.33 47.1
48
  Top 0.15: ATMEGA2560.36 33.78,17.58 41.08,10.28 41.08,8.85 41.87,8.06 44.89,8.06 46,9.17 48.1
49
  Top 0.15: ATMEGA2560.35 33.46,17.27 33.93,16.79 34.09,16.79 40.76,10.12 40.76,8.22 42.19,6.79 49.1
50
  Top 0.15: ATMEGA2560.22 26.31,15.04 25.2,13.93 25.2,12.03 29.97,7.26 29.97,6.31 32.19,4.09 37.74,4.09 38.86,2.98 50.1
  Bottom 0.15: AVR_PROG1.1 11.71,4.09 37.74,4.09 38.86,2.98 50.1
51  (via drill 0.3)
  Top 0.15: v31.08,11.55 31.08,11.87 26.79,16.15 26.47,16.15 26,15.68 ATMEGA2560.21
  Bottom 0.15: v31.08,11.55 34.09,11.55 38.86,6.79 51.1 39.01,6.63 40.13,5.52 40.13,2.5 38.38,0.76 3.45,0.76 1.07,3.14 1.07,11.71 2.98,13.61 3.93,13.61 5.2,14.88 AVR_PROG1.4
52  (via drill 0.3)
  Top 0.15: 24.89,13.61 24.89,9.8 27.43,7.26 27.43,5.99 29.97,3.45 29.97,2.5 30.76,1.71 35.2,1.71 36.32,2.82 52.1 | 24.89,13.61 24.89,15.2 25.52,15.84 ATMEGA2560.20 | 24.89,13.61 v22.35,13.61
  Bottom 0.15: AVR_PROG1.3 6.79,12.34 8.06,13.61 v22.35,13.61
53
  Top 0.15: ATMEGA2560.19 25.36,16.31 25.84,16.79 26.63,16.79 36.32,7.11 36.32,6.79 53.1
A0  (via drill 0.3)
  Top 0.15: v22.98,22.19 22.98,23.62 20.12,26.47 ATMEGA2560.97
  Route15 0.15: v22.98,22.19 22.98,20.44 14.88,12.34 14.88,4.09 16,2.98 A0.1
A1  (via drill 0.3)
  Top 0.15: v23.62,21.55 23.62,23.62 20.44,26.79 ATMEGA2560.96
  Route15 0.15: v23.62,21.55 23.62,20.6 16.15,13.14 16.15,6.79 A1.1
A2  (via drill 0.3)
  Top 0.15: v24.89,20.6 24.73,20.76 24.73,23.14 20.76,27.11 ATMEGA2560.95
  Route15 0.15: v24.89,20.6 24.25,19.96 24.09,19.96 20.12,16 20.12,7.26 19.65,6.79 19.65,3.93 18.69,2.98 A2.1
A3  (via drill 0.3)
  Top 0.15: v25.36,21.23 25.36,23.14 21.08,27.43 ATMEGA2560.94
  Route15 0.15: v25.36,21.23 24.73,21.23 18.69,15.2 18.69,6.79 A3.1
A4  (via drill 0.3)
  Top 0.15: v20.76,29.65 20.76,28.54 21.23,28.06 ATMEGA2560.93
  Route2 0.15: v20.76,29.65 20.76,8.53 22.19,7.11 22.19,3.93 21.23,2.98 A4.1
A5  (via drill 0.3)
  Top 0.15: v20.76,30.44 21.39,29.81 21.39,29.49 21.08,29.17 21.08,29.01 21.71,28.38 ATMEGA2560.92
  Route2 0.15: v20.76,30.44 20.12,29.81 20.12,7.74 21.08,6.79 A5\.1
A6  (via drill 0.3)
  Top 0.15: v24.09,26.47 24.09,26.63 22.19,28.54 ATMEGA2560.91
  Route2 0.15: v24.09,26.47 25.2,26.47 28.7,22.98 28.7,10.76 24.73,6.79 24.73,3.93 23.77,2.98 A6.1
A7  (via drill 0.3)
  Top 0.15: v26,20.6 26.63,21.23 26.63,22.82 26,23.46 26,25.36 22.5,28.85 ATMEGA2560.90
  Route2 0.15: v26,20.6 26,19.49 23.77,17.27 23.77,6.79 A7.1
A8  (via drill 0.3)
  Top 0.15: v24.09,28.06 22.82,29.33 ATMEGA2560.89
  Route2 0.15: v24.09,28.06 29.01,23.14 29.01,8.53 27.27,6.79 27.27,3.93 26.31,2.98 A8.1
A9  (via drill 0.3)
  Top 0.15: v26.95,23.77 26.31,24.41 26.31,26.63 23.3,29.65 ATMEGA2560.88
  Route15 0.15: v26.95,23.77 26.95,22.98 27.9,22.03 27.9,16.79 26.47,15.36 26.47,6.95 26.31,6.79 A9.1
A10  (via drill 0.3)
  Top 0.15: v22.66,30.92 23.46,30.12 ATMEGA2560.87
  Route2 0.15: v22.66,30.92 22.66,30.28 29.49,23.46 29.49,7.42 29.81,7.11 29.81,3.93 28.85,2.98 A10.1
A11  (via drill 0.3)
  Top 0.15: v27.27,21.87 27.58,22.19 27.58,23.93 26.63,24.89 26.63,27.58 23.93,30.28 ATMEGA2560.86
  Route15 0.15: v27.27,21.87 27.27,16.63 25.04,14.41 25.04,6.47 25.84,5.68 27.74,5.68 28.7,6.63 A11.1
A12  (via drill 0.3)
  Top 0.15: v30.12,22.98 29.81,23.3 29.81,25.04 24.25,30.6 ATMEGA2560.85
  Route2 0.15: v30.12,22.98 30.12,4.09 31.24,2.98 A12.1
A13  (via drill 0.3)
  Top 0.15: v28.06,27.58 24.57,31.08 ATMEGA2560.84
  Route2 0.15: v28.06,27.58 28.06,26.79 32.19,22.66 32.19,7.58 31.39,6.79 A13.1
A14  (via drill 0.3)
  Top 0.15: v31.24,24.41 31.24,25.2 25.04,31.39 ATMEGA2560.83
  Route2 0.15: v31.24,24.41 31.24,24.09 32.66,22.66 32.66,4.09 33.78,2.98 A14.1
A15  (via drill 0.3)
  Top 0.15: v31.87,24.89 31.87,25.04 26.16,30.76 26.16,30.92 25.36,31.71 ATMEGA2560.82
  Route15 0.15: v31.87,24.89 31.87,19.33 33.3,17.9 33.3,7.26 33.78,6.79 A15.1
GND  (via drill 0.3, 0.35)
  Top 0.15: v14.73,21.23 13.3,19.81 13.3,19.49 13.26,19.43 | AVR_PROG1.6 7.58,15.84 7.58,22.98 8.22,23.62 12.34,23.62 R5.1
  Top 0.203: 17.75,27.37 19.26,25.87 ATMEGA2560.99 | 18.4,33.21 18.62,32.99 24.82,32.99 25.62,32.19 ATMEGA2560.81 25.62,32.12 v26.69,31.06 | SW1.1 20.59,13.25 21.38,13.25 21.79,13.66 21.79,18.42 22.44,19.06 ATMEGA2560.11 | C4.2 12.69,19.43 13.26,19.43 | ATMEGA2560.32 31.57,17.02 Y1.2 | ATMEGA2560.62 33.78,28.3 v33.78,28.27
  Top 0.406: PC1.- 18.4,33.21 17.73,32.54 17.73,27.56 C5.2 17.75,27.37 | IC1.4 2.79,25.78 5.53,28.51 6.95,28.51 PC2.- 11.26,27.58 C7.2 12.51,25.5 C8.2 12.54,23.62 R5.1
  Top 0.508: SW1.1 16.93,11.3 15.82,10.19 14.41,10.19 GND.1 9.88,7.8 9.88,12.9 8.53,14.24 AVR_PROG1.6
  Route2 0.203: v33.78,28.27 31,31.06 v26.69,31.06
  Bottom 0.15: v14.73,21.23 v14.72,21.22 | IC5.26 13.3,27.58 13.3,27.11 IC5.25 | 11.15,24.57 13.14,24.57 IC5.21 | 30.63,19.84 30.76,19.96 30.76,22.98 33.78,26 33.78,28.22 v33.78,28.27
  Bottom 0.203: J6.1 9.75,27.73 11.15,27.73 | 11.15,27.73 IC5.26 | 11.15,27.73 11.15,24.57 11.15,22.5 13.13,22.5 IC5.18 | C13.1 v14.72,21.22 14.42,21.52 14.42,22.07 13.96,22.53 IC5.18 | IC5.18 16.49,22.53 19.08,25.12 20.26,25.12 IC5.7
  Bottom 0.406: Y1.2 30.63,19.84 30.58,19.84 28.98,18.24 C13.1 14.35,14.88 AVR_PROG1.6
  Bottom 0.508: J6.8 J6.9 J6.6 J6.7 | J6.7 8.86,29.21 J6.1 | J6.7 8.5,33.48 7.92,34.06 R3.1
  other vias: 31.57,18.9
  pour Top (isolate 0.254): -0.09,42.91 -0.09,-0.09 44.91,-0.09 47.91,-0.09 47.91,37.91 47.91,46.91 -0.09,46.91
  pour Bottom (isolate 0.254): -0.09,46.91 -0.09,-0.09 47.91,-0.09 47.91,46.91
LISTRIK  (via drill 0.35)
  Top 0.406: v11.66,11.89 11.82,12.05 D1.A
  Route15 0.406: V_IN.1 10.95,5.15 12.06,6.27 12.06,7.19 11.66,7.6 v11.66,11.89
N$1  (via drill 0.3)
  Top 0.15: v5.36,36.47 6.15,37.27 ORANGE1.2
  Bottom 0.15: v5.36,36.47 6.15,37.27 7.9,37.27 R3.2
N$2  (via drill 0.3)
  Top 0.15: v33.3,19.81 32.03,18.54 32.03,17.27 32.66,16.63 ATMEGA2560.33
  Bottom 0.15: v33.3,19.81 32.51,19.81 32.35,19.65 Y1.3
N$3  (via drill 0.3)
  Top 0.15: v14.73,23.14 13.3,21.71 12.66,21.71 R5.2 | v3.45,36.32 3.45,36.63 4.09,37.27 BLUE1.2
  Route2 0.15: v14.73,23.14 14.73,25.04 v3.45,36.32
N$4  (via drill 0.3)
  Top 0.15: v33.93,16.15 33.14,16.95 ATMEGA2560.34
  Bottom 0.15: v33.93,16.15 32.82,16.15 30.92,18.06 Y1.1
N$19
  Bottom 0.15: C12.2 18.06,31.24 18.06,29.81 19.33,28.54 20.12,28.54 IC5.2
N$20  (via drill 0.3)
  Route15 0.15: v10.6,24.57 v15.52,19.65
  Bottom 0.15: v15.52,19.65 14.73,20.44 13.3,20.44 IC5.15 | v10.6,24.57 9.96,25.2 9.01,25.2 J6.3
N$21
  Bottom 0.15: IC5.16 13.14,21.08 12.19,21.08 11.55,20.44 11.23,20.44 10.44,21.23 10.44,23.93 9.96,24.41 9.01,24.41 J6.4
N$22
  Bottom 0.15: RP4.2 13.93,32.19 13.93,32.51 14.25,32.82 15.68,32.82 16.31,32.19 16.31,28.06 14.09,25.84 13.3,25.84 IC5.23
N$23  (via drill 0.3)
  Route15 0.15: v14.73,29.17 11.87,26.31 v11.71,26.31
  Bottom 0.15: v14.73,29.17 16,30.44 16,31.24 15.52,31.71 15.52,32.03 RP4.4 | v11.71,26.31 11.71,25.68 12.19,25.2 13.14,25.2 IC5.22
N$24  (via drill 0.3)
  Top 0.15: v9.17,36.16 8.06,37.27 TX2.C
  Bottom 0.15: v9.17,36.16 9.17,35.05 12.66,31.55 14.88,31.55 15.36,31.08 15.36,30.92 RP4.5
N$25
  Bottom 0.15: F3.2 7.74,18.06 8.06,18.06 9.65,19.65 9.65,22.98 9.01,23.62 J6.5
N$27  (via drill 0.3)
  Top 0.15: v13.77,29.97 13.77,31.55 10.92,34.41 10.92,36.47 10.12,37.27 RX2.C
  Bottom 0.15: v13.77,29.97 13.77,30.76 RP4.7
N$28  (via drill 0.3)
  Route15 0.15: v16.79,18.38 14.09,18.38 v11.39,21.08
  Bottom 0.15: v16.79,18.38 16,18.38 C13.2 | v11.39,21.08 12.19,21.87 13.14,21.87 IC5.17
RST  (via drill 0.3)
  Top 0.15: v19.49,12.98 19.65,12.98 20.76,14.09 R4.1 | v28.06,16.15 31.08,16.15 31.55,15.68 ATMEGA2560.30 | SW1.2 22.5,11.23 20.44,11.23 17.11,7.9 14.73,7.9 13.61,6.79 RST.1
  Bottom 0.15: v28.06,16.15 25.68,16.15 22.5,12.98 v19.49,12.98 19.49,12.66 13.61,6.79 RST.1 13.46,6.79 8.22,12.03 | 8.22,12.03 7.26,11.07 5.52,11.07 4.72,11.87 4.72,12.82 5.52,13.61 6.47,13.61 7.26,14.41 7.26,15.36 6.47,16.15 5.2,16.15 1.71,19.65 1.71,33.62 9.49,41.4 16.31,41.4 17.27,40.44 17.27,39.49 19.65,37.11 19.65,31.39 C12.1 | 8.22,12.03 AVR_PROG1.5
RX0  (via drill 0.3)
  Top 0.15: v18.38,21.39 19.17,22.19 ATMEGA2560.2
  Bottom 0.15: v18.38,21.39 18.38,20.92 19.17,20.12 21.23,20.12 22.35,21.23 22.35,27.74 21.08,29.01 20.28,29.01 IC5.1 20.12,29.17 19.01,30.28 19.01,31.39 11.07,39.33 11.07,39.81 0.1
RX1  (via drill 0.3)
  Top 0.15: v36.47,25.04 36,25.04 35.52,24.57 35.52,22.19 36.79,20.92 ATMEGA2560.45
  Bottom 0.15: v36.47,25.04 36.16,25.36 36.16,30.28 41.87,36 42.67,36 43.78,37.11 43.78,40.44 42.19,42.03 35.52,42.03 33.93,43.62 19.1
RX2  (via drill 0.3)
  Top 0.15: v24.25,19.33 23.3,19.33 22.82,18.85 ATMEGA2560.12 | v24.73,33.62 24.73,34.09 30.12,39.49 30.12,42.51 31.24,43.62 17.1
  Bottom 0.15: v24.25,19.33 24.25,25.84 24.73,26.31 v24.73,33.62
RX3  (via drill 0.3)
  Top 0.15: v35.36,30.92 35.36,30.6 34.57,29.81 ATMEGA2560.63
  Bottom 0.15: v35.36,30.92 35.36,35.05 32.35,38.06 32.35,39.17 32.51,39.33 32.51,40.44 29.33,43.62 28.85,43.62 15.1
TX0  (via drill 0.3)
  Top 0.15: v18.22,25.2 18.38,25.2 20.12,23.46 20.12,22.5 19.65,22.03 ATMEGA2560.3
  Route2 0.15: v18.22,25.2 17.74,25.2 12.03,30.92 12.03,42.67 11.07,43.62 1.1
  Bottom 0.15: v18.22,25.2 19.33,26.31 20.12,26.31 IC5.5
TX1  (via drill 0.3)
  Top 0.15: v36.16,24.41 36.16,22.35 37.27,21.23 ATMEGA2560.46
  Bottom 0.15: v36.16,24.41 35.84,24.73 35.84,30.6 41.08,35.84 41.08,37.74 41.87,38.54 42.67,38.54 43.46,39.33 43.46,40.28 42.67,41.08 35.05,41.08 33.93,39.97 18.1
TX2  (via drill 0.3)
  Top 0.15: v22.35,17.42 23.14,18.22 ATMEGA2560.13
  Route2 0.15: v22.35,17.42 22.35,19.01 v26,22.66
  Bottom 0.15: v26,22.66 26,29.65 27.9,31.55 27.9,39.01 27.58,39.33 27.58,40.28 28.38,41.08 30.12,41.08 31.24,39.97 16.1
TX3  (via drill 0.3)
  Top 0.15: v34.73,31.24 34.73,30.6 34.25,30.12 ATMEGA2560.64
  Bottom 0.15: v34.73,31.24 34.73,33.93 28.85,39.81 14.1
VIN
  Top 0.406: 10.47,19.29 9.82,19.94 IC1.1 | 10.47,19.29 D1.C | PC1.+ 16.39,31.53 C5.1 15.44,25.27 15.44,24.79 13.16,22.51 11.86,22.51 10.47,21.12 10.47,19.29
VUSB
  Bottom 0.15: F3.1 9.33,17.9 11.07,17.9 D3.P$2

### Text on the board
tPlace: 1 | 3 | 5 | 7 | 9 | 11 | 13 | 15 | 17 | 19 | 21 | 23 | 0 | 2 | 4 | 6 | 8 | 10 | 12 | 14 | 16 | 18 | 20 | 22 | 24 | 25 | 26 | 27 | 28 | 29 | 30 | GND | 31 | 32 | 33 | 34 | VCC | TX | 35 | 36 | 37 | RX | 38 | DTR | 39 | 40 | 41 | 42 | 43 | 44 | 45 | 46 | 47 | 48 | GND | RST | A1 | A3 | A5 | A7 | A9 | A11 | A13 | A15 | 53 | 51 | 49 | VCC | 5V | A0 | A2 | A4 | A6 | A8 | A10 | A12 | A14 | 52 | 50
bPlace: TXO | RX3 | RX2 | RX1 | SCL | RX0 | TX3 | TX2 | TX1 | SDA | Arsa Merah W | Designed in Surabaya